# EAGLE design diskohedron4w_revb (EAGLE 6.5.0)
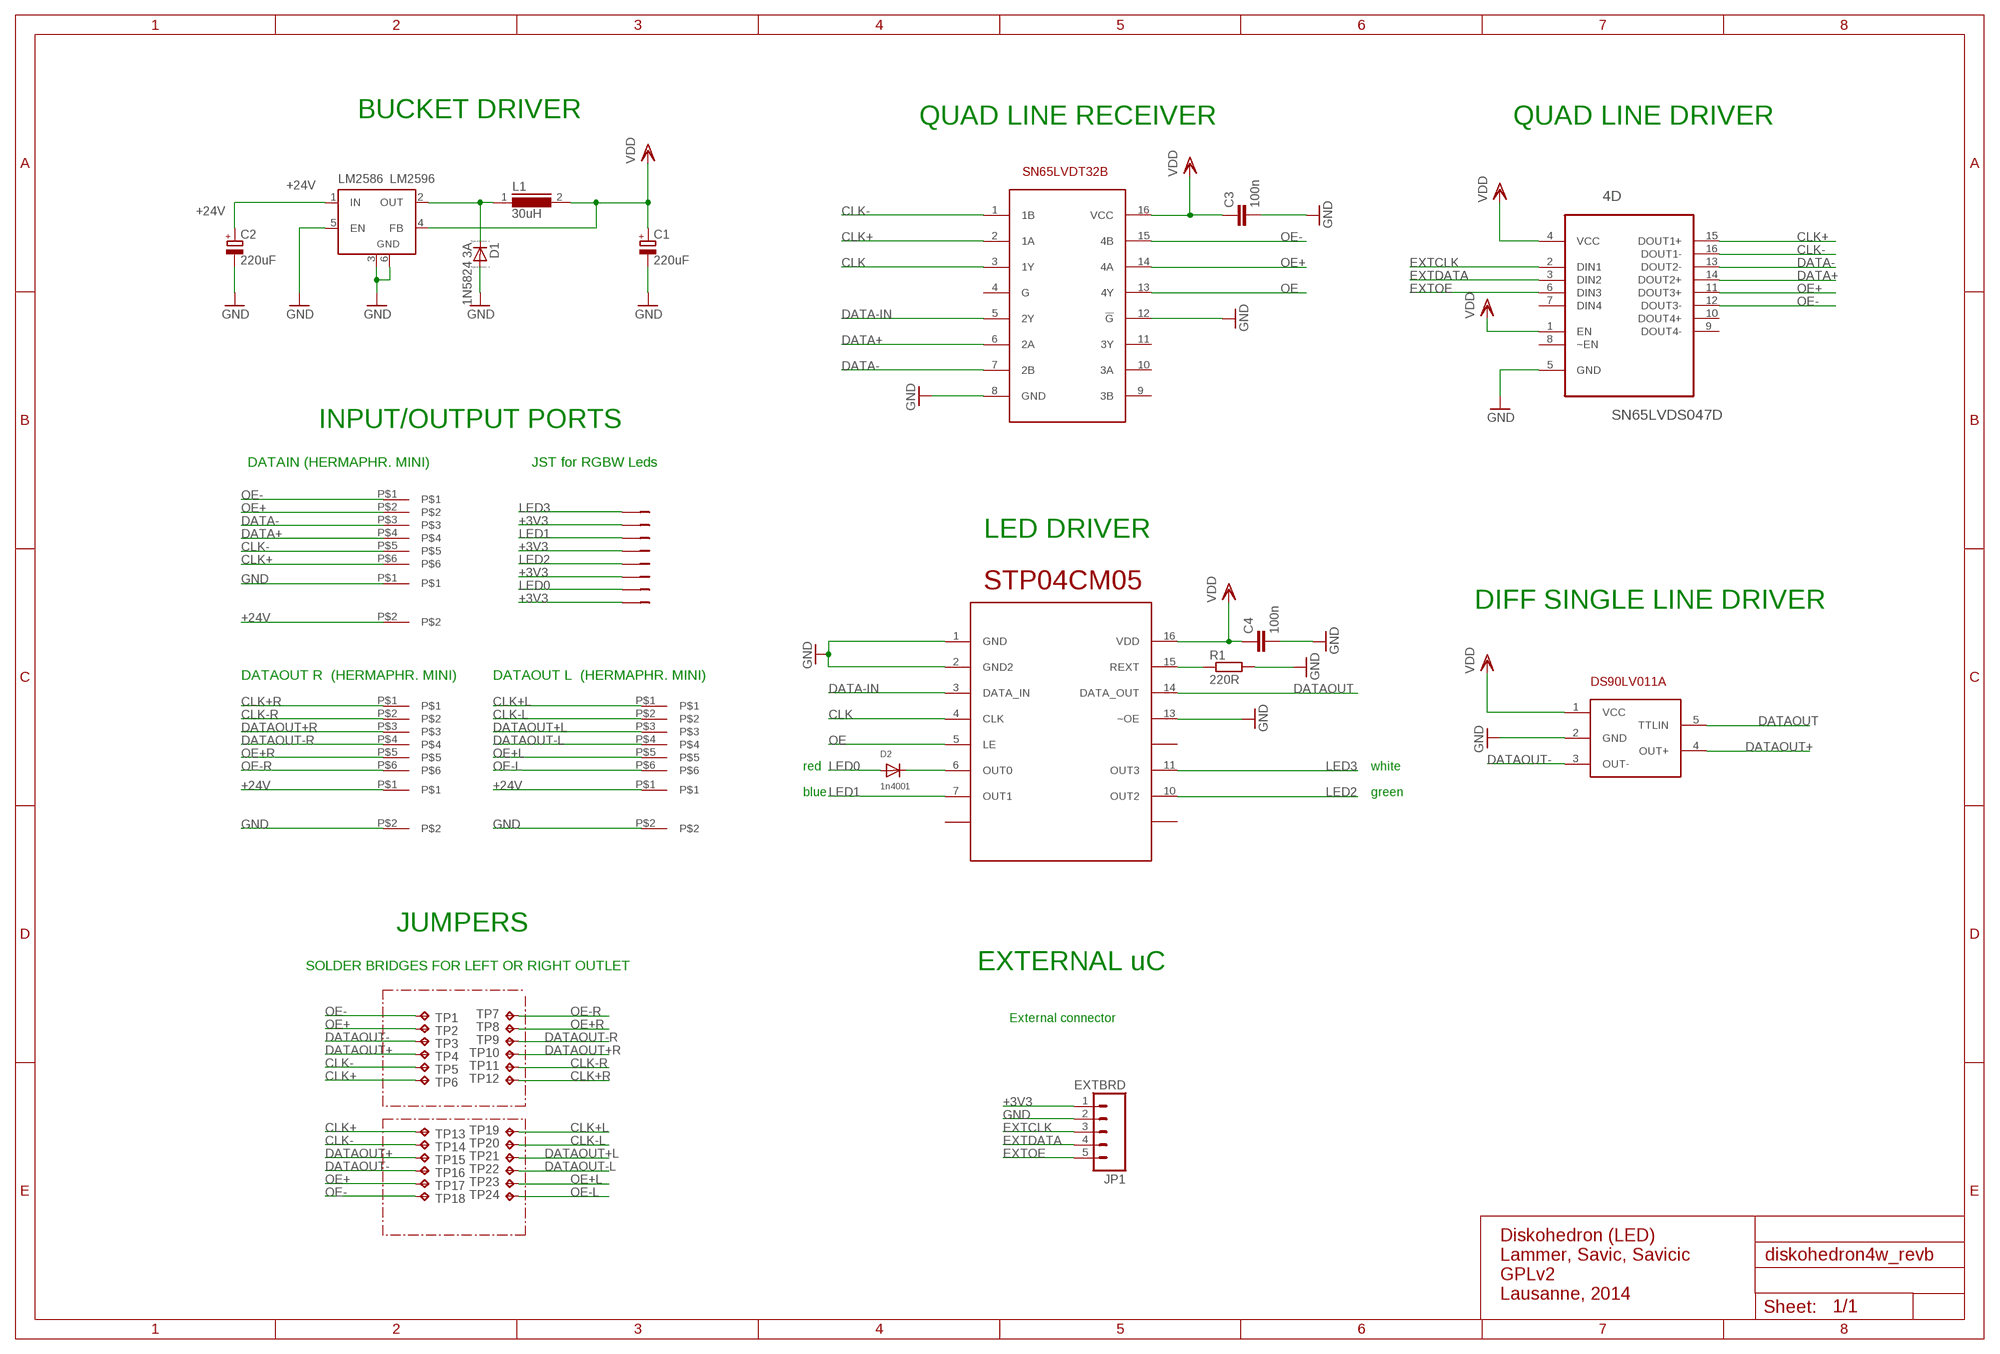
[diagram p0: schematic, sheet 1]

## Parts
1D  DS90LV011A  [SOT23-5]
4D  SN65LVDS047D  [SOIC127P600X175-16N]
4R  SN65LVDST32  [SOIC16]
C1  220uF  CPOL-EU175TMP-0810  [175TMP-0810]
C2  220uF  CPOL-EU175TMP-0810  [175TMP-0810]
C3  100n  C-EUC0805  [C0805]
C4  100n  C-EUC0805  [C0805]
D1  1N5824 3A  DIODE_E-SMC  [DIODE_SMC]
D2  1n4001  DIODESMA  [SMADIODE]
IN1  HERMAPHRODITMINI6PIN  [HERMAPHRODITMINI6PIN]
JP1  EXTBRD  M05PTH  [1X05]
JST  8PIN-ZH  [B8B-ZH]
L1  30uH  DR127  [DR127]
LM2586  LM2596  LM2596S  [TO263-5]
OUT-L  HERMAPHRODITMINI6PIN  [HERMAPHRODITMINI6PIN]
OUT-R  HERMAPHRODITMINI6PIN  [HERMAPHRODITMINI6PIN]
R1  220R  R-EU_M0805  [M0805]
STP04  STP04CM05  [TSSOP16]
TP1  TPTP12SQ  [TP12SQ]
TP2  TPTP12SQ  [TP12SQ]
TP3  TPTP12SQ  [TP12SQ]
TP4  TPTP12SQ  [TP12SQ]
TP5  TPTP12SQ  [TP12SQ]
TP6  TPTP12SQ  [TP12SQ]
TP7  TPTP12SQ  [TP12SQ]
TP8  TPTP12SQ  [TP12SQ]
TP9  TPTP12SQ  [TP12SQ]
TP10  TPTP12SQ  [TP12SQ]
TP11  TPTP12SQ  [TP12SQ]
TP12  TPTP12SQ  [TP12SQ]
TP13  TPTP12SQ  [TP12SQ]
TP14  TPTP12SQ  [TP12SQ]
TP15  TPTP12SQ  [TP12SQ]
TP16  TPTP12SQ  [TP12SQ]
TP17  TPTP12SQ  [TP12SQ]
TP18  TPTP12SQ  [TP12SQ]
TP19  TPTP12SQ  [TP12SQ]
TP20  TPTP12SQ  [TP12SQ]
TP21  TPTP12SQ  [TP12SQ]
TP22  TPTP12SQ  [TP12SQ]
TP23  TPTP12SQ  [TP12SQ]
TP24  TPTP12SQ  [TP12SQ]
U$6  HERMAPHRODIT2PIN  [HERMAPHRODIT2PIN]
U$7  HERMAPHRODIT2PIN  [HERMAPHRODIT2PIN]
U$12  HERMAPHRODIT2PIN  [HERMAPHRODIT2PIN]

## Nets
+3V3: 1D.1(VCC) 4D.1(EN) 4D.4(VCC) 4R.16(VCC) C1.+ C3.1 C4.1 JP1.1 JST.2 JST.4 JST.6 JST.8 L1.2 LM2586.4(FB) STP04.16(VDD) ; supply symbol labelled VDD
+24V: C2.+ LM2586.1(IN) U$6.P$1 U$7.P$2 U$12.P$1
CLK: 4R.3(1Y) STP04.4(CLK)
CLK+: 4D.15(DOUT1+) 4R.2(1A) IN1.P$6 TP6.TP TP13.TP
CLK+L: OUT-L.P$1 TP19.TP
CLK+R: OUT-R.P$1 TP12.TP
CLK-: 4D.16(DOUT1-) 4R.1(1B) IN1.P$5 TP5.TP TP14.TP
CLK-L: OUT-L.P$2 TP20.TP
CLK-R: OUT-R.P$2 TP11.TP
DATA+: 4D.14(DOUT2+) 4R.6(2A) IN1.P$4
DATA-: 4D.13(DOUT2-) 4R.7(2B) IN1.P$3
DATA-IN: 4R.5(2Y) STP04.3(DATA_IN)
DATAOUT: 1D.5(TTLIN) STP04.14(DATA_OUT)
DATAOUT+: 1D.4(OUT+) TP4.TP TP15.TP
DATAOUT+L: OUT-L.P$3 TP21.TP
DATAOUT+R: OUT-R.P$3 TP10.TP
DATAOUT-: 1D.3(OUT-) TP3.TP TP16.TP
DATAOUT-L: OUT-L.P$4 TP22.TP
DATAOUT-R: OUT-R.P$4 TP9.TP
EXTCLK: 4D.2(DIN1) JP1.3
EXTDATA: 4D.3(DIN2) JP1.4
EXTOE: 4D.6(DIN3) JP1.5
GND: 1D.2(GND) 4D.5(GND) 4R.8(GND) 4R.12(!G) C1.- C2.- C3.2 C4.2 D1.A(C) JP1.2 LM2586.3(GND) LM2586.5(EN) LM2586.6(GND) R1.2 STP04.1(GND) STP04.2(GND2) STP04.13(~OE) U$6.P$2 U$7.P$1 U$12.P$2
LED0: D2.A JST.7
LED1: JST.3 STP04.7(OUT1)
LED2: JST.5 STP04.10(OUT2)
LED3: JST.1 STP04.11(OUT3)
N$1: R1.1 STP04.15(REXT)
N$2: D1.C(A) L1.1 LM2586.2(OUT)
N$3: D2.C STP04.6(OUT0)
OE: 4R.13(4Y) STP04.5(LE)
OE+: 4D.11(DOUT3+) 4R.14(4A) IN1.P$2 TP2.TP TP17.TP
OE+L: OUT-L.P$5 TP23.TP
OE+R: OUT-R.P$5 TP8.TP
OE-: 4D.12(DOUT3-) 4R.15(4B) IN1.P$1 TP1.TP TP18.TP
OE-L: OUT-L.P$6 TP24.TP
OE-R: OUT-R.P$6 TP7.TP
Unconnected: 4D.7(DIN4) 4D.8(~EN) 4D.9(DOUT4-) 4D.10(DOUT4+) 4R.4(G) 4R.9(3B) 4R.10(3A) 4R.11(3Y) STP04.8(N.C1) STP04.9(NC) STP04.12(NC3)

## Notes on the sheet
- BUCKET DRIVER | QUAD LINE RECEIVER | QUAD LINE DRIVER
- INPUT/OUTPUT PORTS
- DATAIN (HERMAPHR. MINI) | JST for RGBW Leds
- LED DRIVER
- DIFF SINGLE LINE DRIVER
- DATAOUT R  (HERMAPHR. MINI) | DATAOUT L  (HERMAPHR. MINI)
- red | white
- blue | green
- JUMPERS
- SOLDER BRIDGES FOR LEFT OR RIGHT OUTLET | EXTERNAL uC
- External connector
- for Arduino, etc.
- not differentiated
- Diskohedron (LED)
  Lammer, Savic, Savicic
  GPLv2
  Lausanne, 2014

## Library data of the parts
1D = diskohedron:DS90LV011A: 3V LVDS Single High Speed Differential Driver
4D = Texas Instruments_By_element14_Batch_1:SN65LVDS047D: LVDS QUAD DIFFERENTIAL LINE DRIVER; MPN: SN65LVDS047D; OC_FARNELL: 8452350; OC_NEWARK: 75C7839; PACKAGE: SOIC-16; SUPPLIER: TEXAS INSTRUMENTS
4R = diskohedron:SN65LVDST32
C1 C2 = rcl:CPOL-EU: POLARIZED CAPACITOR, European symbol
C3 C4 = rcl:C-EU: CAPACITOR, European symbol
D1 = eagle-ltspice:DIODE_E-: Schottky Diode; SPICEMODEL: diode; SPICEPREFIX: D
D2 = adafruit:DIODE: Diode SMADIODE - SMA Surface Mount Package 20V 1A Schottky Diode Digikey: 641-1014-6-ND DO-1N4148 - Through Hole Small Current Diode SOD-123 20V 1 A (.5mV Vf) Schottky Diode - Digikey: MBRX120TPMSCT-ND SOD-323 10V 570mA (.38mV Vf, 3ns) Schottky Diode - Digikey: ZLLS410CT-ND SOD-523 30V 30mA Schottky Diode (RB751S-40TE61) - Digikey: RB751S-40TE61CT-ND SOT23-R/W - SOT23 Package (R = Solder Paste/Reflow Ovens, W = Hand-Soldering) BAT54Film 40V 300mA - Digikey: 497-7162-1-ND
IN1 OUT-L OUT-R = diskohedron:HERMAPHRODITMINI6PIN: MINIATURE HERMAPHRODITIC (6P) 1971567-3 TE Internal Number: 1971567-3 http://www.te.com/catalog/bin/TE.Connect?S=29506&M=PPROP&P=&BML=&LG=1&PG=1&IDS=517146,517147,517148&N=3
JP1 = SparkFun-Connectors:M05: Header 5 Standard 5-pin 0.1" header. Use with straight break away headers (SKU : PRT-00116), right angle break away headers (PRT-00553), swiss pins (PRT-00743), machine pins (PRT-00117), and female headers (PRT-00115). Molex polarized connector foot print use with SKU : PRT-08230 with associated crimp pins and housings.
JST = diskohedron:8PIN-ZH
L1 = inductors:DR127: High Power Density, High Efficiency, Shielded Inductors Source: coiltronics_dr_series.pdf
LM2586 = linear:LM2596S: STEP-DOWN VOLTAGE REGULATOR
R1 = resistor:R-EU_: RESISTOR, European symbol
STP04 = stp04:STP04CM05
TP1-TP24 = testpad:TP: Test pad
U$6 U$7 U$12 = diskohedron:HERMAPHRODIT2PIN: Hermaphroditic Blade and Receptacle Connectors TE Internal Number: 1954289-1 http://www.te.com/catalog/pn/en/1954289-1?RQPN=1954289-1

## Board
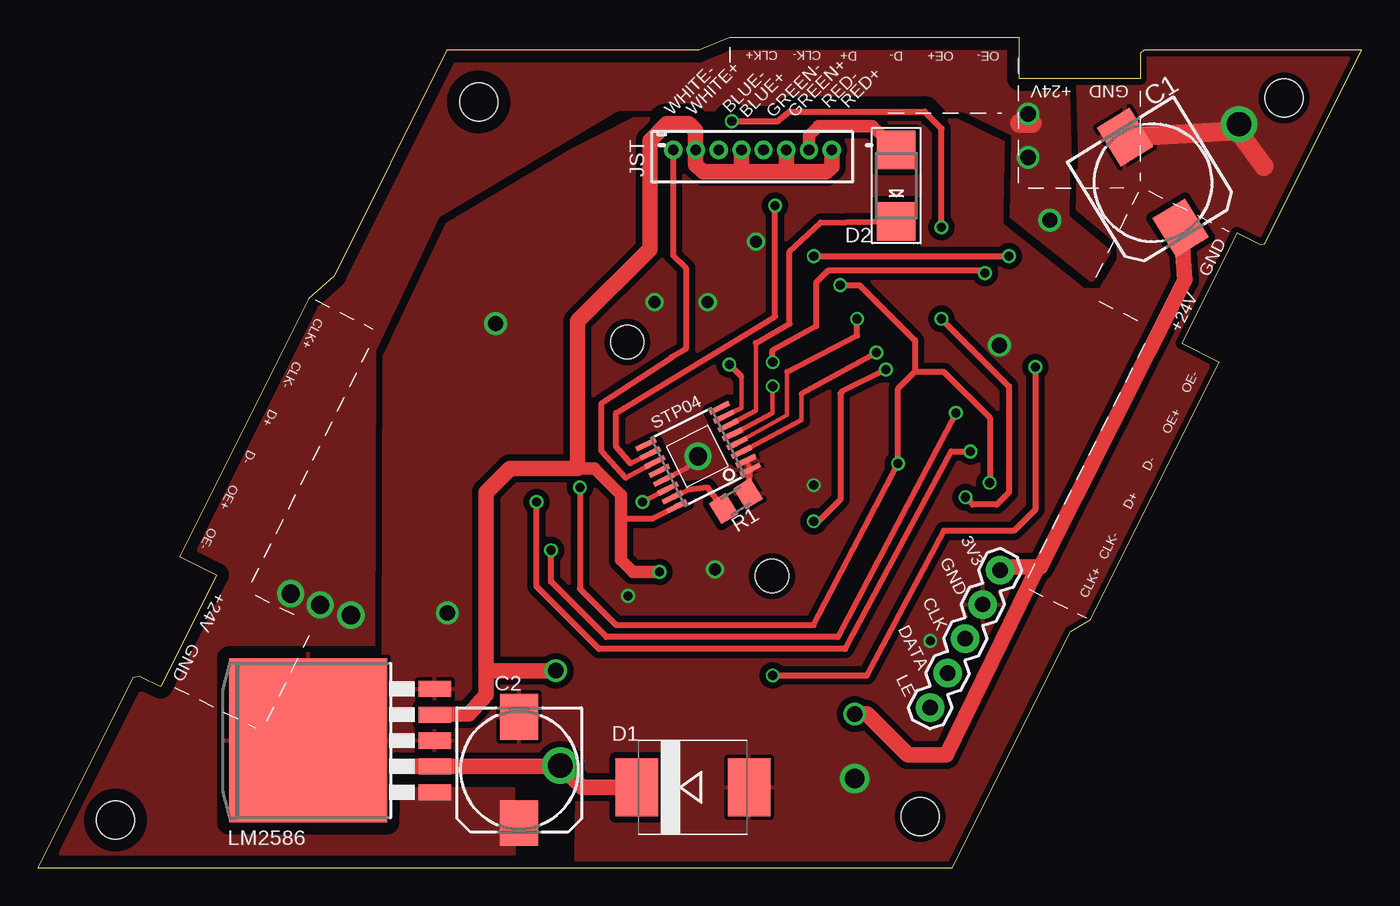
[diagram p1: board, top side]
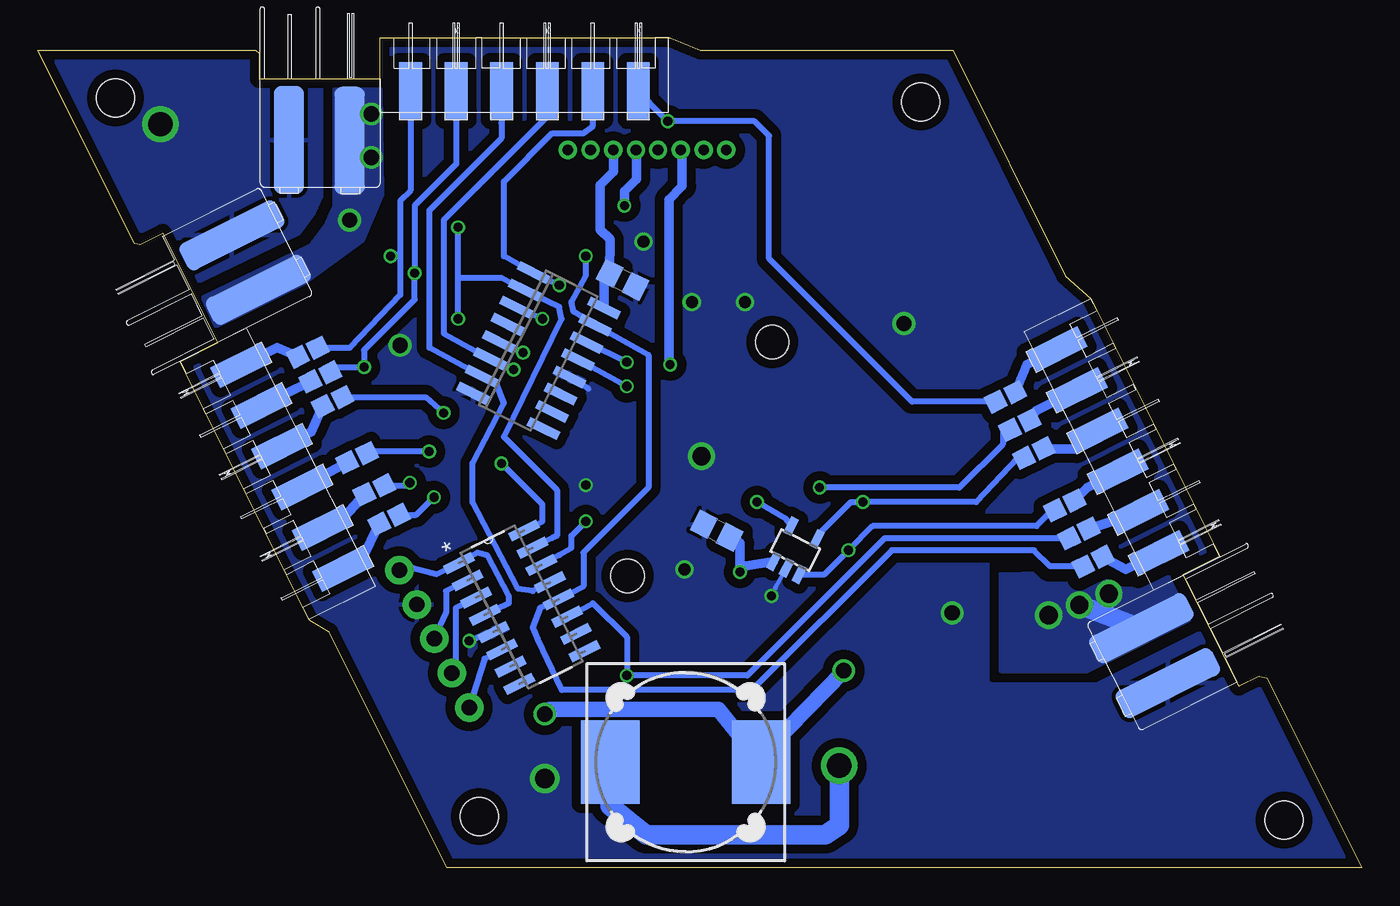
[diagram p2: board, bottom side, seen from below]

Size 87.17 x 54.68 mm. Coordinates in mm from the lower left corner, seen from the top.
Outline: 0,0 60.23,0 68,15.55 69.3,16.35 77.81,33.34 75.32,34.58 78.97,41.83 80.47,41.08 80.8,41.12 87.17,53.88 72.85,53.88 72.6,53.68 72.6,52 64.62,52 64.62,54.68 45.55,54.68 43.55,53.88 26.93,53.88 19.5,39 17.83,37.5 9.34,20.51 11.76,19.3 8.07,11.95 6.72,12.62 6.25,12.53 0,0
Copper layers (1*16): Top 0.035mm / dielectric 1.5mm / Bottom 0.035mm
Design rules "ITEADstudio_DRC": minimum track width 6mil, minimum drill 12mil, track to track 6mil, track to pad 6mil, pad to pad 6mil, via to via 6mil, smd to smd 0mil, copper to edge 10mil, drill to drill 10mil, minimum pad ring 10mil, minimum via ring 6mil, stop-mask expansion 2mil, vias tented up to drill 100mil, thermal gap 10mil
Holes 2.5 mm at 5.1,3.15 82.06,50.73 29.03,50.46 58.11,3.39
Holes 2.2 mm at 38.81,34.64 48.35,19.22
Milling: 25 lines

### Footprints (pad centres in the part's own frame; a part is rotated, then mirrored left to right if it is on the bottom)
SOT23-5 = smd 0.55 x 1.2: 1 -0.95,-1.3; 2 0,-1.3; 3 0.95,-1.3; 4 0.95,1.3; 5 -0.95,1.3
SOIC127P600X175-16N = smd 2.057 x 0.61: 1 -4.801,8.89; 2 -4.801,7.62; 3 -4.801,6.35; 4 -4.801,5.08; 5 -4.801,3.81; 6 -4.801,2.54; 7 -4.801,1.27; 8 -4.801,0; 9 0,0; 10 0,1.27; 11 0,2.54; 12 0,3.81; 13 0,5.08; 14 0,6.35; 15 0,7.62; 16 0,8.89
SOIC16 = smd 0.6 x 2.2: 1 -4.445,-2.6; 2 -3.175,-2.6; 3 -1.905,-2.6; 4 -0.635,-2.6; 5 0.635,-2.6; 6 1.905,-2.6; 7 3.175,-2.6; 8 4.445,-2.6; 9 4.445,2.6; 10 3.175,2.6; 11 1.905,2.6; 12 0.635,2.6; 13 -0.635,2.6; 14 -1.905,2.6; 15 -3.175,2.6; 16 -4.445,2.6
175TMP-0810 = smd 3 x 2.5: + 3.5,0; - -3.5,0
C0805 = smd 1.3 x 1.5: 1 -0.95,0; 2 0.95,0
DIODE_SMC = smd 2.8 x 3.8: A 3.7,0; C -3.7,0
SMADIODE = smd 2.54 x 2.54: A 2.349,0; C -2.349,0
HERMAPHRODITMINI6PIN = smd 1.5 x 3.8: P$1 1.996,1.406; P$2 4.997,1.406; P$3 7.997,1.406; P$4 10.997,1.406; P$5 13.997,1.406; P$6 16.997,1.406
1X05 = drill 1.016 pad 1.88: 1 0,0; 2 2.54,0; 3 5.08,0; 4 7.62,0; 5 10.16,0
B8B-ZH = drill 0.7 pad 1.1: 1 -2.25,0; 2 -0.75,0; 3 0.75,0; 4 2.25,0; 5 3.7,0; 6 5.2,0; 7 6.7,0; 8 8.2,0
DR127 = smd 3.85 x 5.5: 1 -4.975,0; 2 4.975,0
TO263-5 = smd 1.067 x 2.159: 1 -3.404,-5.791; 2 -1.702,-5.791; 3 0,-5.791; 4 1.702,-5.791; 5 3.404,-5.791 | smd 10.8 x 10.41: 6 0,2.54
M0805 = smd 1.3 x 1.6: 1 -0.95,0; 2 0.95,0
TSSOP16 = smd 0.35 x 1.43: 1 -2.275,-2.7; 2 -1.625,-2.7; 3 -0.975,-2.7; 4 -0.325,-2.7; 5 0.325,-2.7; 6 0.975,-2.7; 7 1.625,-2.7; 8 2.275,-2.7; 9 2.275,2.7; 10 1.625,2.7; 11 0.975,2.7; 12 0.325,2.7; 13 -0.325,2.7; 14 -0.975,2.7; 15 -1.625,2.7; 16 -2.275,2.7
TP12SQ = smd 1.2 x 1.2: TP 0,0
HERMAPHRODIT2PIN = smd 2 x 7.1: P$1 1.9,3.5; P$2 5.9,3.45

### Placement (x,y rotation side)
1D  37.29,20.93 333.4 bottom
4D  51.18,14.28 26.6 bottom
4R  54.22,34.07 243.4 bottom
C1  73.43,45.15 301.5 top
C2  31.7,6.45 270 top
C3  48.68,38.73 333.4 bottom
C4  42.47,22.22 153.4 bottom
D1  43.13,5.31 0 top
D2  56.53,44.95 90 top
IN1  64.63,49.78 0 bottom
JP1  63.38,19.62 243 top
JST  44.08,47.29 0 top
L1  44.52,6.96 0 bottom
LM2586  20.35,8.39 90 top
OUT-L  22.23,35.32 296.6 bottom
OUT-R  64.93,18.56 116.6 bottom
R1  45.96,24.16 31.5 top
STP04  43.48,27.07 116.6 top
TP1  68.74,34.28 206.6 bottom
TP2  67.92,32.64 206.6 bottom
TP3  67.11,31.01 206.6 bottom
TP4  65.5,27.31 206.6 bottom
TP5  64.37,25.2 206.6 bottom
TP6  63.4,23.25 206.6 bottom
TP7  70.04,33.68 206.6 bottom
TP8  69.23,32.05 206.6 bottom
TP9  68.42,30.42 206.6 bottom
TP10  66.81,26.72 206.6 bottom
TP11  65.68,24.61 206.6 bottom
TP12  64.7,22.66 206.6 bottom
TP13  24.09,30.71 26.6 bottom
TP14  23.16,28.86 26.6 bottom
TP15  22.23,27.01 26.6 bottom
TP16  20.19,23.57 26.6 bottom
TP17  19.26,21.71 26.6 bottom
TP18  18.33,19.86 26.6 bottom
TP19  22.8,31.34 26.6 bottom
TP20  21.87,29.49 26.6 bottom
TP21  20.94,27.64 26.6 bottom
TP22  18.9,24.2 26.6 bottom
TP23  17.97,22.34 26.6 bottom
TP24  17.04,20.49 26.6 bottom
U$6  68.67,37.94 116.6 bottom
U$7  72.54,44.45 0 bottom
U$12  18.49,15.92 296.6 bottom

### Tracks (layer width: path | path; a pad name or v marks a point on that pad's centre or on a via)
+3V3  (via drill 0.6, 1)
  Top 0.406: STP04.16 40.46,22.99 38.71,22.99 38.39,22.68
  Top 0.61: 43.23,47.59 JST.2
  Top 0.813: 35.54,26.33 36.65,26.33 38.39,24.58 38.39,22.68 38.39,20.3 39.19,19.5 v40.93,19.5
  Top 1.016: C1.+ 75.54,38.71 66.02,19.82 65.86,19.82 | LM2586.4 28.39,10.13 29.5,11.4 29.5,12.99 | 29.5,12.99 29.5,24.74 31.09,26.33 35.54,26.33 35.54,36.01 40.3,40.77 40.3,47.92 41.41,49.03 42.84,49.03 43.31,48.55 43.31,47.31 JST.2 | v34.11,12.99 29.5,12.99 | 65.86,19.82 63.58,19.82 JP1.1 | 65.86,19.82 59.82,7.44 57.28,7.44 54.59,10.13 v53.79,10.13 | JST.2 43.31,47.27 43.31,46.33 43.79,45.85 46.4,45.85 | 46.4,45.85 49.28,45.85 | 49.28,45.85 51.95,45.85 52.28,46.19 JST.8 | JST.8 | JST.4 46.33,45.92 46.4,45.85 | JST.6 49.28,45.86 49.28,45.85 | JST.2
  Bottom 0.406: 4D.4 56.17,17.44 56.17,17.91 57.6,20.61 58.24,20.77 4D.1 60.94,19.34 62.84,19.82 | 41.09,21.57 C4.1
  Bottom 0.61: 4R.16 49.9,38.78 C3.1 49.51,41.41 50.14,42.04 50.14,44.99 49.28,45.85 JST.6 | 1D.1 40.55,19.88 v40.93,19.5 40.93,21.41 41.09,21.57 | 62.84,19.82 JP1.1
  Bottom 1.016: v34.11,12.99 39.03,7.92 | L1.2 42.36,10.45 53.47,10.45 v53.79,10.13
  Bottom 1.27: L1.2 39.03,7.92 38.63,7.92
+24V  (via drill 1, 1.2, 1.2 pad 1.68)
  Top 1.27: 64.67,49.08 65.47,49.08
  Bottom 1.27: U$12.P$1 v18.59,17.33
  other vias: 20.61,16.64 65.22,49.66 66.65,42.68 16.64,18.07 65.22,46.81
  pour Top (isolate 0.813): 67.77,53.38 67.97,46.52 61.08,49.85 38.18,49.98 26.33,42.94 22.13,34.13 22.07,14.76 21.04,3.5 29.58,3.38 29.18,0.73 0.08,0.53 6.47,12.38 7.07,12.57 10.78,19.98 8.67,21.08 16.88,37.88 19.98,38.88 27.08,53.58 43.88,53.58 45.77,54.62 64.47,54.62 64.47,53.38
  pour Top (isolate 0.813, no thermals): 23.93,5.38 31.29,5.3 31.34,0.43 23.98,0.51
  pour Bottom (no thermals): 67.62,51.27 67.62,45.38 67.64,43.58 68.12,42.49 69.26,40.95 76.29,37.58 75.44,35.68 69.47,38.62 65.82,41.3 64.5,44.39 64.6,51.26
  pour Top (isolate 0.813): 64.26,51.35 64.1,42.9 69.4,38.68 70.58,40.59 67.82,42.87 67.88,45.38 67.88,50.98
  pour Bottom (isolate 0.813, no thermals): 12.36,19.98 15.53,18.71 16.8,19.5 23.79,19.34 23.79,12.99 18.07,12.99 11.09,16.49
CLK  (via drill 0.6)
  Top 0.305: STP04.4 49.35,29.82 49.35,32.68
  Top 0.406: 49.35,32.68 53.95,35.06 v53.95,36.17
  Bottom 0.406: v53.95,36.17 4R.3
CLK+  (via drill 0.6)
  Top 0.406: v59.51,42.2 59.51,48.71 58.4,49.82 49.51,49.82 48.71,49.19 v45.7,49.19 | v59.51,36.17 63.95,31.73 63.95,24.74 63.15,23.94 61.57,23.94 v61.09,24.42
  Bottom 0.406: 47.54,50.72 47.54,51.09 IN1.P$6 46.68,50.14 v45.7,49.19 39.98,49.19 39.03,48.23 39.03,40.14 29.6,30.71 TP13.TP | TP6.TP 62.26,23.25 v61.09,24.42 | 4D.15 53.32,21.72 53,21.88 53,24.9 56.49,28.39 52.68,36.17 52.84,36.96 4R.2 56.65,38.87 59.51,38.87 | 59.55,42.16 v59.51,42.2 59.51,38.87 | v59.51,36.17 59.51,38.87
CLK+L
  Bottom 0.61: OUT-L.P$1 22.04,33.15 TP19.TP
CLK+R
  Bottom 0.406: 65.86,20.3 OUT-R.P$1
  Bottom 0.61: TP12.TP 65.86,20.3
CLK-  (via drill 0.6)
  Top 0.406: v62.68,25.38 62.68,29.66 59.66,32.68 57.92,32.68 57.84,32.76 | v52.84,38.39 54.11,38.39 57.76,34.74 57.76,32.84 57.84,32.76 | 57.84,32.76 56.65,31.57 v56.65,26.65 51.09,16.01 38.08,16.01 35.69,18.39 v35.69,25.06
  Bottom 0.406: IN1.P$5 50.63,50.14 50.62,50.12 50.62,48.87 51.25,48.39 53.32,48.39 56.49,45.22 56.49,40.3 4R.1 v52.84,38.39 | TP14.TP 23.64,28.86 23.64,27.91 26.49,25.06 v35.69,25.06 | TP5.TP 62.85,25.2 v62.68,25.38 | 4D.16 53.95,22.84 53.95,23.95 v56.65,26.65
CLK-L
  Bottom 0.406: OUT-L.P$2 18,31.95
  Bottom 0.61: OUT-L.P$2 21.41,30.14 TP20.TP
CLK-R
  Bottom 0.406: 66.97,23.15 OUT-R.P$2
  Bottom 0.61: TP11.TP 66.97,23.15
DATA+  (via drill 0.6)
  Top 0.406: v55.86,32.84 53,31.41 52.84,31.25 52.84,24.26 51.41,22.84 v51.09,22.84
  Bottom 0.406: IN1.P$4 53.42,50.26 | 53.42,50.26 53.32,49.82 53.32,49.51 | v55.86,32.84 4R.6 60.46,35.22 60.46,42.68 53.79,49.35 53.79,49.89 53.42,50.26 | 4D.14 52.84,20.61 52.05,21.09 52.05,21.88 v51.09,22.84
DATA-
  Bottom 0.406: 4D.13 54.59,18.23 55.54,18.39 58.55,24.11 58.55,26.65 56.49,30.61 56.97,31.88 4R.7 61.41,34.27 61.41,43.31 56.65,48.08 56.65,49.03 IN1.P$3
DATA-IN  (via drill 0.6)
  Top 0.305: STP04.3 50.3,29.5 50.3,31.25
  Top 0.406: 50.3,31.25 v55.22,33.95
  Bottom 0.406: v55.22,33.95 4R.5
DATAOUT  (via drill 0.6)
  Top 0.305: 39.88,24.14 v39.82,24.11 39.68,23.95 39.88,24.14 | 39.88,24.14 STP04.14
  Bottom 0.406: 1D.5 37.92,23 v39.82,24.11
DATAOUT+  (via drill 0.6)
  Top 0.406: v32.84,24.11 32.84,18.55 36.96,14.42 53.16,14.42 60.14,27.44 v61.41,27.44
  Bottom 0.406: TP15.TP 22.63,27.01 25.38,24.11 v32.84,24.11 33.63,24.11 35.86,21.87 1D.4 | v61.41,27.44 65.38,27.44 TP4.TP
DATAOUT+L
  Bottom 0.61: OUT-L.P$3 17.51,28.8 18.71,27.6 20.9,27.6 TP21.TP
DATAOUT+R
  Bottom 0.61: TP10.TP OUT-R.P$3
DATAOUT-  (via drill 0.6)
  Top 0.406: v60.46,29.98 52.68,15.21 37.44,15.21 33.79,18.87 v33.79,20.93
  Bottom 0.406: TP16.TP 20.36,23.57 21.41,22.52 32.2,22.52 v33.79,20.93 | TP3.TP 61.65,31.01 v60.46,29.98 | 33.79,20.77 v33.79,20.93 | 1D.3 35.37,19.35 v33.79,20.93
DATAOUT-L
  Bottom 0.61: TP22.TP 18.07,25.06 OUT-L.P$4
DATAOUT-R
  Bottom 0.61: TP9.TP 69.19,28.71 OUT-R.P$4
EXTCLK
  Bottom 0.406: 4D.2 60.3,18.23 60.3,16.8 JP1.3
EXTDATA
  Bottom 0.406: 4D.3 59.35,17.28 59.66,17.12 59.66,13.79 JP1.4
EXTOE
  Bottom 0.406: 4D.6 57.76,13.79 JP1.5
GND  (via drill 0.6, 0.8, 1, 1.2, 1.3 pad 0.81, 1.6)
  Top 0.305: STP04.2 STP04.1 | STP04.13 42.68,26.33 v43.47,27.12
  Top 0.406: C1.- 71.68,49.66 | R1.2 STP04.1
  Top 1.27: 80.75,46.21 79.04,48.56 C1.-
  Bottom 0.305: 1D.2 38.55,18.55 v38.87,17.91
  Bottom 0.406: 50.93,31.57 4R.12 | 4D.5 v58.77,14.95
  other vias: 79.1,48.99 53.8,5.89 51.09,25.22 63.32,34.42 40.62,37.28 44.11,37.28 30.14,35.85 26.96,16.8 47.28,41.25 44.58,19.66
  pour Top (isolate 0.406, rank 3): 35.4,-0.8 60.18,-1.02 68.47,14.88 72.07,15.78 80.47,32.48 78.77,34.18 81.77,40.58 84.38,44.68 88.88,54.68 72.77,54.48 71.57,54.98 68.27,55.08 68.06,45.53 65.07,50.27 39.77,49.58 26.48,42.88 15.88,22.08 15.24,20.88 12.02,14.8 11.87,6.38 26.28,6.47 35.55,6.47
  pour Bottom (isolate 0.61, rank 3): -0.43,-0.53 89.38,-0.53 89.38,56.58 -0.43,56.58
LED0
  Top 0.406: D2.A 55.55,47.3
  Top 0.813: JST.7 50.77,48.23 51.41,48.87 54.96,48.87 D2.A
LED1  (via drill 0.6)
  Top 0.305: STP04.7 46.33,30.3 46.33,32.36
  Top 0.406: v45.54,33.15 46.33,32.36
  Bottom 0.406: 45.63,33.25 v45.54,33.15
  Bottom 0.61: 45.63,33.25 45.63,44.02 44.74,44.9 44.74,47.2 JST.3
LED2  (via drill 0.6)
  Top 0.305: STP04.10 39.03,26.65
  Top 0.406: 39.03,26.65 38.08,27.76 38.08,29.98 48.55,36.33 v48.55,43.63
  Bottom 0.406: 47.76,47.42 JST.5
  Bottom 0.61: v48.55,43.63 48.55,44.58 47.76,45.38 47.76,47.42
LED3
  Top 0.305: STP04.11 38.71,25.69
  Top 0.406: 38.71,25.69 37.12,27.44 37.12,30.61 41.73,33.63 42.63,34.16 42.68,34.21 42.68,39.5 41.83,40.35 JST.1
N$1
  Top 0.305: 42.84,24.9 STP04.15
  Top 0.406: R1.1 44.11,25.06 42.84,24.9
N$2  (via drill 1.6)
  Top 1.016: 23.75,6.7 LM2586.2 34.35,6.69 v34.4,6.74 35.83,5.31 D1.C
  Bottom 1.27: 48.42,7.92 L1.1 49.51,6.63 49.51,4.1 47.12,2.2 35.32,2.2 34.4,2.79 v34.4,6.74
N$3
  Top 0.305: STP04.6 47.28,30.14 47.28,34.58
  Top 0.406: 47.28,34.58 49.51,35.85 49.51,40.62 51.57,42.52 D2.C
OE  (via drill 0.6)
  Top 0.305: STP04.5 48.39,29.98 v48.39,31.73
  Bottom 0.406: v48.39,31.73 4R.13
OE+  (via drill 0.6)
  Top 0.406: v48.39,33.31 48.39,34.11 51.25,35.69 51.25,38.55 52.05,39.34 62.2,39.34 v62.36,39.19 | v48.39,12.67 54.59,12.67 59.66,22.2 64.27,22.2 65.7,23.63 v65.7,33
  Bottom 0.406: 4R.14 v48.39,33.31 | TP17.TP 31.42,21.71 40.46,12.67 v48.39,12.67 48.39,15.21 50.62,17.44 4D.11 | IN1.P$2 59.63,46.36 62.36,43.63 v62.36,39.19 62.36,37.44 65.7,34.11 v65.7,33 | 65.89,32.8 v65.7,33 | TP2.TP 67.57,33 v65.7,33
OE+L
  Bottom 0.61: 14.87,23.49 OUT-L.P$5 TP23.TP
OE+R
  Bottom 0.61: TP8.TP OUT-R.P$5
OE-  (via drill 0.6)
  Top 0.406: v51.09,40.3 v63.95,40.3
  Bottom 0.406: v51.09,40.3 51.09,39.03 52.05,37.28 51.89,36.65 4R.15 46.97,33.79 46.97,25.06 51.25,20.77 51.25,18.55 4D.12 54.11,17.12 54.59,15.85 54.27,15.06 52.68,11.72 40.14,11.72 30.93,20.93 21.57,20.93 20.5,19.86 TP18.TP | IN1.P$1 62.63,44.63 63.32,43.95 63.32,40.46 | 63.32,40.46 63.32,37.76 66.64,34.27 TP1.TP | v63.95,40.3 63.32,40.46
OE-L
  Bottom 0.61: TP24.TP 15.53,19.66 OUT-L.P$6
OE-R
  Bottom 0.61: TP7.TP 71.41,34.27 OUT-R.P$6

### Text on the board
tPlace: +24V | GND | GND | +24V | +24V | GND
tNames: CLK+ | CLK- | D+ | D- | OE+ | OE- | WHITE- | WHITE+ | BLUE- | RED- | RED+ | BLUE+ | GREEN- | GREEN+ | CLK+ | CLK- | OE- | D+ | STP04 | OE+ | D- | D- | OE+ | D+ | OE- | 3V3 | CLK- | GND | CLK+ | CLK | DATA | LE
bSilk: INPUT | GND | +24V | GND | OUT-L | * | +24V | * | +24V | OUT-R | GND | SAVIC / LAMMER / SAVICIC | DISKO / HEDRON | rev.B | 06/2014
geo-helper: rotation angles: / 63.4 / 26.6